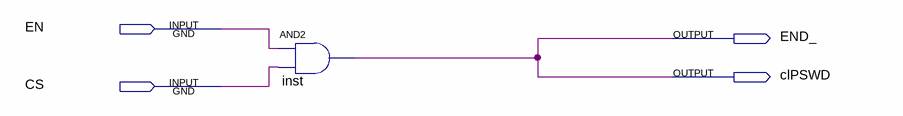
[diagram p0: schematic sheet]
// Quartus schematic CLD.bdf as structural Verilog: 1 symbols, 4 pins
module CLD (
  input  EN,
  input  CS,
  output END_,
  output clPSWD
);

  and inst (clPSWD, EN, CS);

  assign END_ = clPSWD;
endmodule
